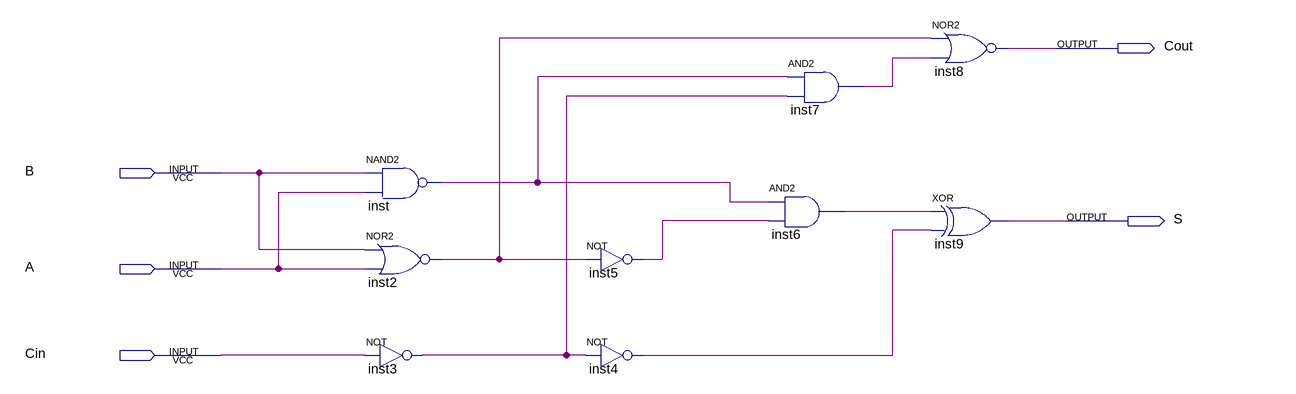
[diagram p0: schematic sheet]
// Quartus schematic 1bit.bdf as structural Verilog: 9 symbols, 5 pins
module \1bit  (
  input  B,
  input  A,
  input  Cin,
  output Cout,
  output S
);

  wire inst2_out, inst3_out, inst4_out, inst5_out, inst6_out, inst7_out, inst_out;

  nand inst (inst_out, B, A);
  nor inst2 (inst2_out, B, A);
  not inst3 (inst3_out, Cin);
  not inst5 (inst5_out, inst2_out);
  not inst4 (inst4_out, inst3_out);
  and inst7 (inst7_out, inst_out, inst3_out);
  and inst6 (inst6_out, inst_out, inst5_out);
  nor inst8 (Cout, inst2_out, inst7_out);
  xor inst9 (S, inst6_out, inst4_out);
endmodule
